# Altium schematic sheet sche_sim7600.SchDoc
size C
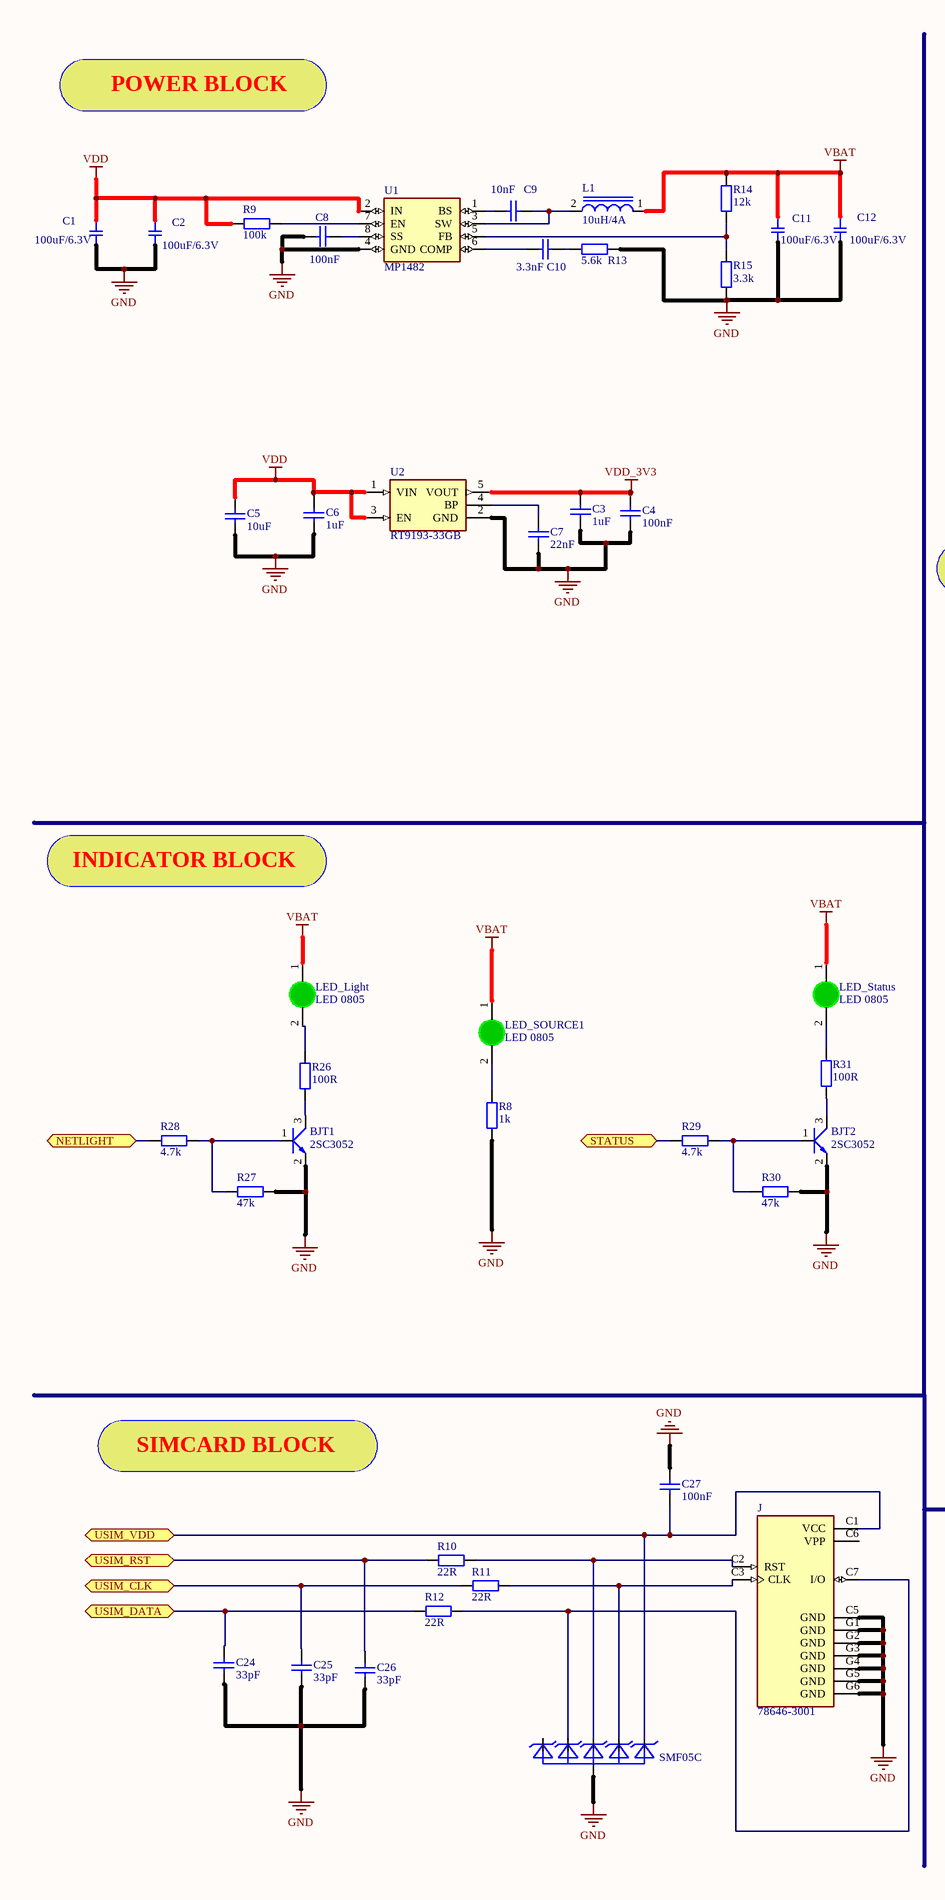
[diagram p0: sche_sim7600.SchDoc, left]
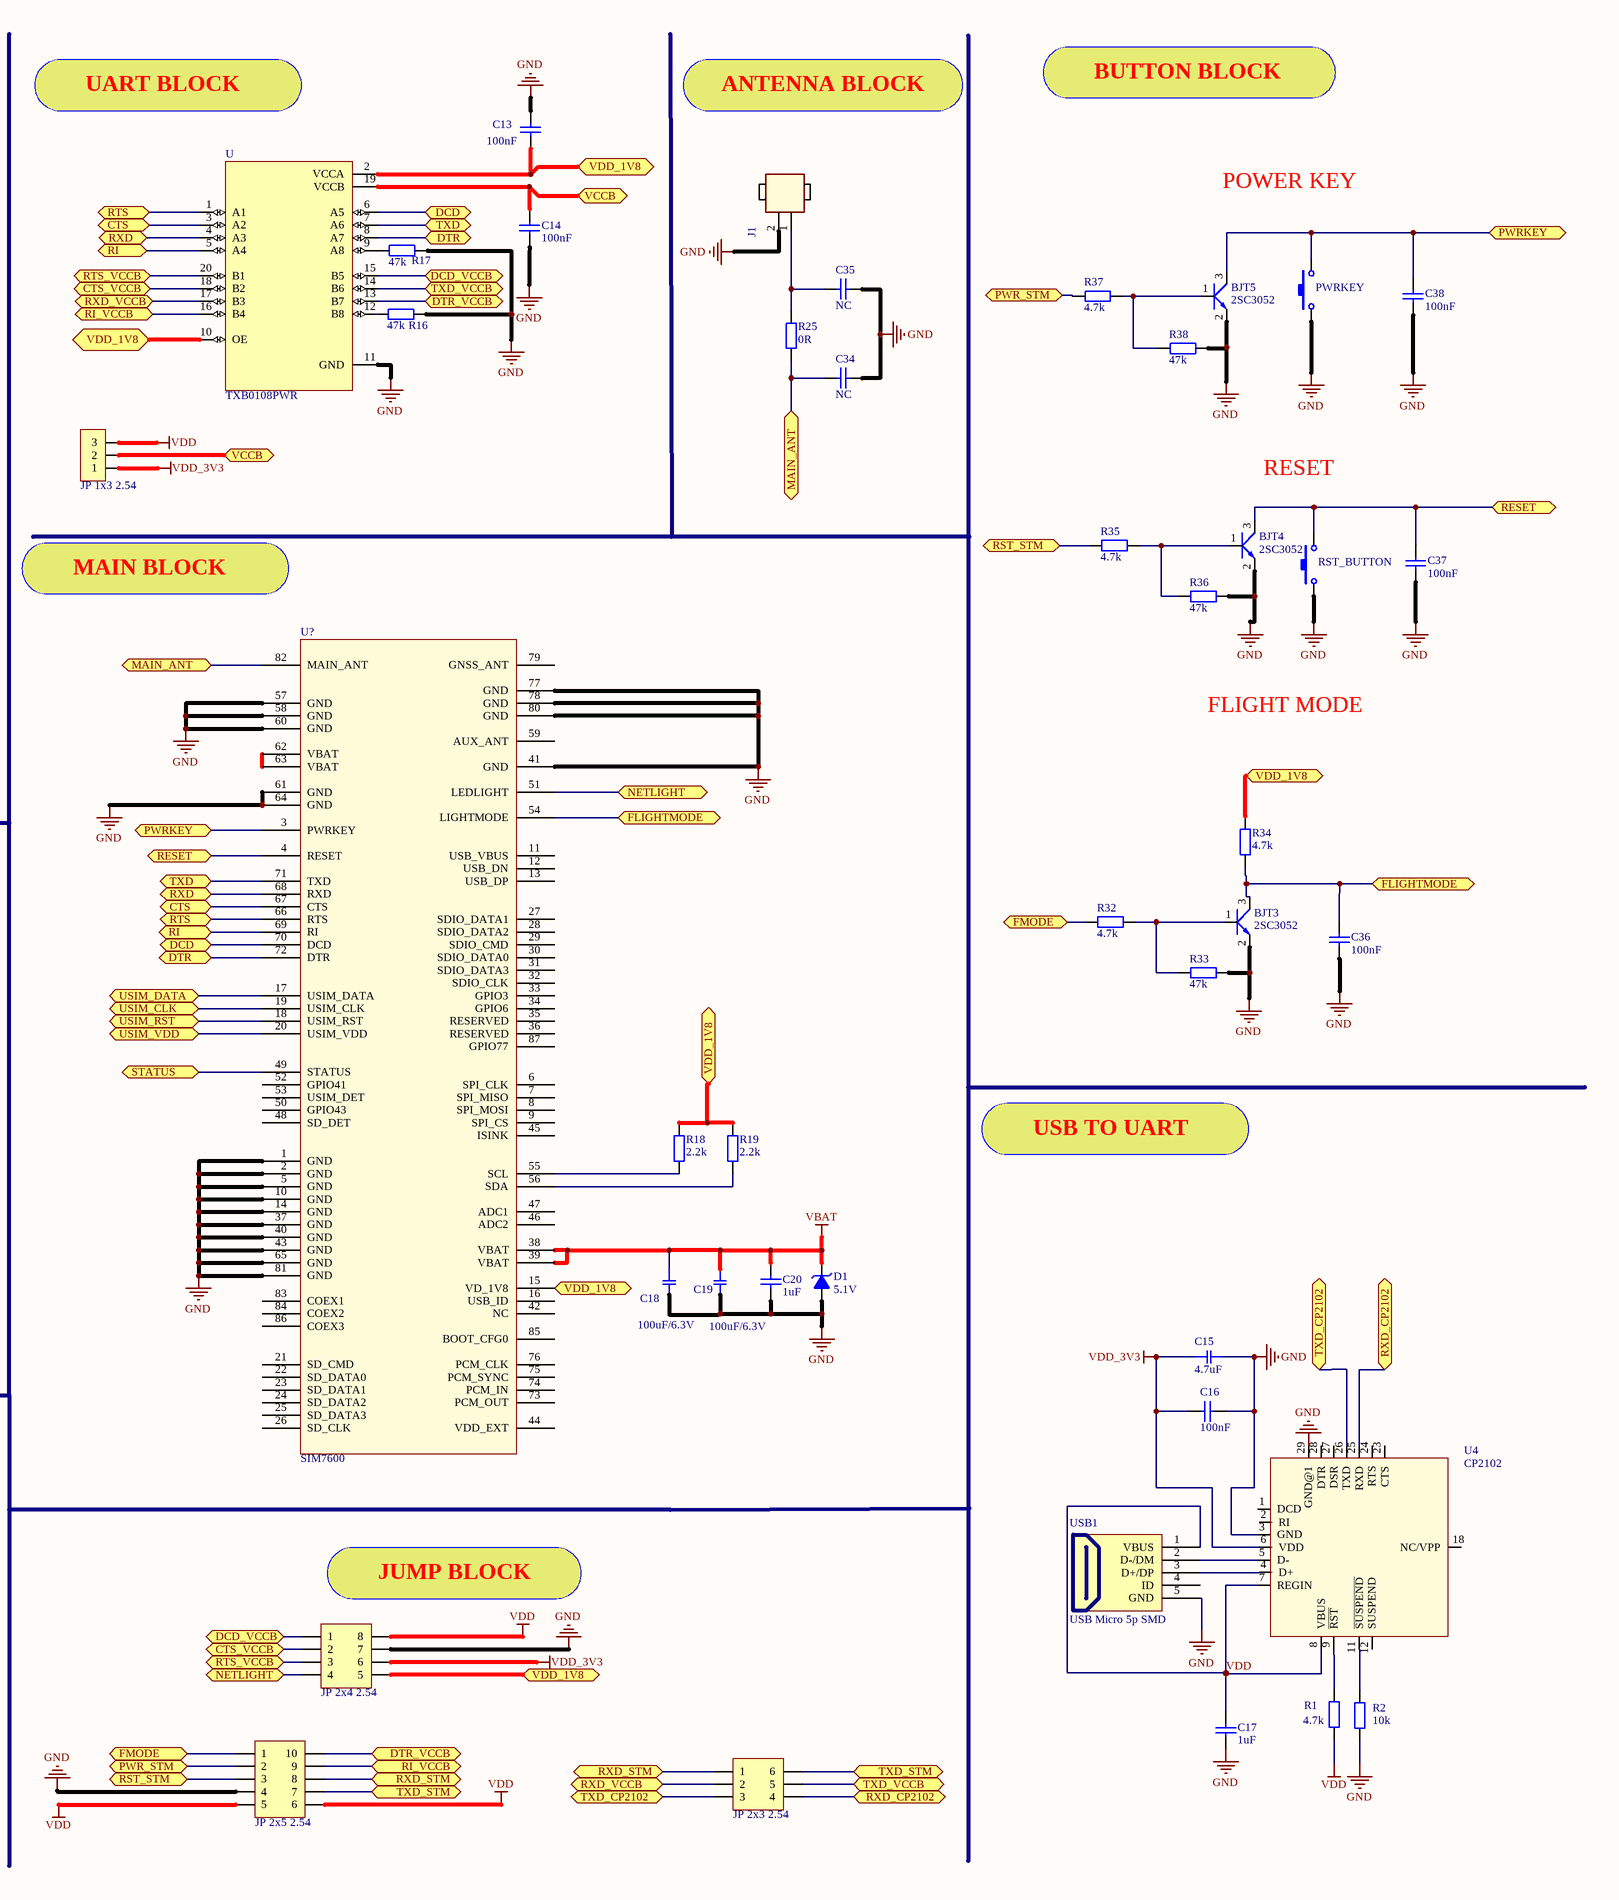
[diagram p1: sche_sim7600.SchDoc, right]

## Parts
BJT1  2SC3052  [SOT23-3]
BJT2  2SC3052  [SOT23-3]
BJT3  2SC3052  [SOT23-3]
BJT4  2SC3052  [SOT23-3]
BJT5  2SC3052  [SOT23-3]
C1  100uF/6.3V  [SMD-1210C]
C2  100uF/6.3V  [SMD-1210C]
C3  1uF  [tu 0805]
C4  100nF  [tu 0805]
C5  10uF  [tu 1206]
C6  1uF  [tu 0805]
C7  22nF  [tu 0805]
C8  100nF  [tu 0805]
C9  10nF  [tu 0805]
C10  3.3nF  [tu 0805]
C11  100uF/6.3V  [SMD-1210C]
C12  100uF/6.3V  [SMD-1210C]
C13  100nF  [tu 0805]
C14  100nF  [tu 0805]
C15  4.7uF  [SMD-1210C]
C16  100nF  [tu 0805]
C17  1uF  [tu 0805]
C18  100uF/6.3V  [SMD-1210C]
C19  100uF/6.3V  [SMD-1210C]
C20  1uF  [tu 0805]
C24  33pF  [tu 0805]
C25  33pF  [tu 0805]
C26  33pF  [tu 0805]
C27  100nF  [tu 0805]
C34  NC  [tu 0603]
C35  NC  [tu 0603]
C36  100nF  [tu 0805]
C37  100nF  [tu 0805]
C38  100nF  [tu 0805]
D  SMF05C  [SC70-6]
D1  5.1V  [DIODE ZENNER SMD SOD80]
J  78646-3001  [MOLEX_78646-3001]
J1  SMA  [*SAMTEC_SMA-J-P-H-RA-TH1]  (value not drawn)
JP1  JP 1x3 2.54  [JP 1x3 DT]
JP3  JP 2x5 2.54  [JP 2x5 DT]
JP4  JP 2x3 2.54  [JP 2x3 DT]
JP?  JP 2x4 2.54  [JP 2x4 DT]
L1  10uH/4A  [INDP125125X600N]
LED_Light  LED 0805  [LED-0805-Green]
LED_SOURCE1  LED 0805  [LED-0805-Green]
LED_Status  LED 0805  [LED-0805-Green]
PWRKEY  Nut Nhan 2 Chan SMD 3x6x2.5  [Nut Nhan 2 Chan SMD 3x6x2.5]  (value not drawn)
R1  4.7k  [tro smd 0805]
R2  10k  [tro smd 0805]
R8  1k  [tro smd 0805]
R9  100k  [tro smd 0805]
R10  22R  [tro smd 0805]
R11  22R  [tro smd 0805]
R12  22R  [tro smd 0805]
R13  5.6k  [tro smd 0805]
R14  12k  [tro smd 0805]
R15  3.3k  [tro smd 0805]
R16  47k  [tro smd 0805]
R17  47k  [tro smd 0805]
R18  2.2k  [tro smd 0805]
R19  2.2k  [tro smd 0805]
R25  0R  [tro smd 0805]
R26  100R  [tro smd 0805]
R27  47k  [tro smd 0805]
R28  4.7k  [tro smd 0805]
R29  4.7k  [tro smd 0805]
R30  47k  [tro smd 0805]
R31  100R  [tro smd 0805]
R32  4.7k  [tro smd 0805]
R33  47k  [tro smd 0805]
R34  4.7k  [tro smd 0805]
R35  4.7k  [tro smd 0805]
R36  47k  [tro smd 0805]
R37  4.7k  [tro smd 0805]
R38  47k  [tro smd 0805]
RST_BUTTON  Nut Nhan 2 Chan SMD 3x6x2.5  [Nut Nhan 2 Chan SMD 3x6x2.5]  (value not drawn)
U  TXB0108PWR  [SOP65P640X120-20N]
U1  MP1482  [SOIC8]
U2  RT9193-33GB  [SOT94P279X129-5N]
U4  CP2102  [QFN28G_0.5-5X5MM]
U?  SIM7600  [IC_SIM7600E-H]
USB1  USB Micro 5p SMD  [USB Micro 5P SMD]

## Ports
CTS, CTS_VCCB, DCD, DCD_VCCB, DTR, DTR_VCCB, FLIGHTMODE, FMODE, MAIN_ANT, NETLIGHT, PWR_STM, PWRKEY, RESET, RI, RI_VCCB, RST_STM, RTS, RTS_VCCB, RXD, RXD_CP2102, RXD_STM, RXD_VCCB, STATUS, TXD, TXD_CP2102, TXD_STM, TXD_VCCB, USIM_CLK, USIM_DATA, USIM_RST, USIM_VDD, VCCB, VDD_1V8

## Nets
GND: BJT1.2(E) BJT2.2(E) BJT3.2(E) BJT4.2(E) BJT5.2(E) C1.2 C2.2 C3.2 C4.2 C5.2 C6.2 C7.2 C8.2 C11.2 C12.2 C13.1 C14.2 C15.2 C16.2 C17.2 C18.2 C19.2 C20.2 C24.2 C25.2 C26.2 C27.1 C34.2 C35.2 C36.2 C37.2 C38.2 D.2(A) D1.1(A) J.C5(GND) J.G1(GND) J.G2(GND) J.G3(GND) J.G4(GND) J.G5(GND) J.G6(GND) J1.2 JP3.4 JP?.7 PWRKEY.1 R2.2 R8.2 R13.2 R15.1 R16.2 R17.2 R27.1 R30.1 R33.1 R36.1 R38.1 RST_BUTTON.1 U.11(GND) U1.4(GND) U2.2(GND) U4.3(GND) U4.29(GND@1) U?.1(GND) U?.2(GND) U?.5(GND) U?.10(GND) U?.14(GND) U?.37(GND) U?.40(GND) U?.41(GND) U?.43(GND) U?.57(GND) U?.58(GND) U?.60(GND) U?.61(GND) U?.64(GND) U?.65(GND) U?.77(GND) U?.78(GND) U?.80(GND) U?.81(GND) USB1.5(GND)
VBAT: C11.1 C12.1 C18.1 C19.1 C20.1 D1.2(K) L1.1 LED_Light.1(A) LED_SOURCE1.1(A) LED_Status.1(A) R14.2 U?.38(VBAT) U?.39(VBAT)
VDD: C1.1 C2.1 C5.1 C6.1 C17.1 JP1.3 JP3.5 JP3.6 JP?.8 R1.2 R9.1 U1.2(IN) U2.1(VIN) U2.3(EN) U4.7(REGIN) U4.8(VBUS) USB1.1(VBUS)
VDD_3V3: C3.1 C4.1 C15.1 C16.1 JP1.1 JP?.6 U2.5(VOUT) U4.6(VDD)
CTS: U.3(A2) U?.67(CTS) ; port CTS
CTS_VCCB: JP?.2 U.18(B2) ; port CTS_VCCB
DCD: U.6(A5) U?.70(DCD) ; port DCD
DCD_VCCB: JP?.1 U.15(B5) ; port DCD_VCCB
DTR: U.8(A7) U?.72(DTR) ; port DTR
DTR_VCCB: JP3.10 U.13(B7) ; port DTR_VCCB
FLIGHTMODE: BJT3.3(C) C36.1 R34.2 U?.54(LIGHTMODE) ; port FLIGHTMODE
FMODE: JP3.1 R32.2 ; port FMODE
MAIN_ANT: C34.1 R25.2 U?.82(MAIN_ANT) ; port MAIN_ANT
NETLIGHT: JP?.4 R28.2 U?.51(LEDLIGHT) ; port NETLIGHT
PWR_STM: JP3.2 R37.2 ; port PWR_STM
PWRKEY: BJT5.3(C) C38.1 PWRKEY.2 U?.3(PWRKEY) ; port PWRKEY
RESET: BJT4.3(C) C37.1 RST_BUTTON.2 U?.4(RESET) ; port RESET
RI: U.5(A4) U?.69(RI) ; port RI
RI_VCCB: JP3.9 U.16(B4) ; port RI_VCCB
RST_STM: JP3.3 R35.2 ; port RST_STM
RTS: U.1(A1) U?.66(RTS) ; port RTS
RTS_VCCB: JP?.3 U.20(B1) ; port RTS_VCCB
RXD: U.4(A3) U?.68(RXD) ; port RXD
RXD_CP2102: JP4.4 U4.25(RXD) ; port RXD_CP2102
RXD_STM: JP3.8 JP4.1 ; port RXD_STM
RXD_VCCB: JP4.2 U.17(B3) ; port RXD_VCCB
STATUS: R29.2 U?.49(STATUS) ; port STATUS
TXD: U.7(A6) U?.71(TXD) ; port TXD
TXD_CP2102: JP4.3 U4.26(TXD) ; port TXD_CP2102
TXD_STM: JP3.7 JP4.6 ; port TXD_STM
TXD_VCCB: JP4.5 U.14(B6) ; port TXD_VCCB
USIM_CLK: C25.1 R11.2 U?.19(USIM_CLK) ; port USIM_CLK
USIM_DATA: C24.1 R12.2 U?.17(USIM_DATA) ; port USIM_DATA
USIM_RST: C26.1 R10.2 U?.18(USIM_RST) ; port USIM_RST
USIM_VDD: C27.2 D.6(C5) J.C1(VCC) U?.20(USIM_VDD) ; port USIM_VDD
VCCB: C14.1 JP1.2 U.19(VCCB) ; port VCCB
VDD_1V8: C13.2 JP?.5 R18.2 R19.2 R34.1 U.2(VCCA) U.10(OE) U?.15(VD_1V8) ; port VDD_1V8
NetBJT1_1: BJT1.1(B) R27.2 R28.1
NetBJT1_3: BJT1.3(C) R26.2
NetBJT2_1: BJT2.1(B) R29.1 R30.2
NetBJT2_3: BJT2.3(C) R31.1
NetBJT3_1: BJT3.1(B) R32.1 R33.2
NetBJT4_1: BJT4.1(B) R35.1 R36.2
NetBJT5_1: BJT5.1(B) R37.1 R38.2
NetC7_1: C7.1 U2.4(BP)
NetC8_1: C8.1 U1.8(SS)
NetC9_1: C9.1 L1.2 U1.3(SW)
NetC9_2: C9.2 U1.1(BS)
NetC10_1: C10.1 R13.1
NetC10_2: C10.2 U1.6(COMP)
NetC35_1: C35.1 J1.1 R25.1
NetD_3: D.3(C2) J.C7(I/O) R12.1
NetD_4: D.4(C3) J.C2(RST) R10.1
NetD_5: D.5(C4) J.C3(CLK) R11.1
NetLED_Light_2: LED_Light.2(K) R26.1
NetLED_SOURCE1_2: LED_SOURCE1.2(K) R8.1
NetLED_Status_2: LED_Status.2(K) R31.2
NetR1_1: R1.1 U4.9(~{RST})
NetR2_1: R2.1 U4.11(~{SUSPEND})
NetR9_2: R9.2 U1.7(EN)
NetR14_1: R14.1 R15.2 U1.5(FB)
NetR16_1: R16.1 U.12(B8)
NetR17_1: R17.1 U.9(A8)
NetR18_1: R18.1 U?.55(SCL)
NetR19_1: R19.1 U?.56(SDA)
NetU4_4: U4.4(D+) USB1.3(D+/DP)
NetU4_5: U4.5(D-) USB1.2(D-/DM)
NetU?_62: U?.62(VBAT) U?.63(VBAT)

Not connected (* = marked no-connect by the designer): D 1(C1); J C6(VPP); U4 1(DCD) 2(RI) 12(SUSPEND) 18(NC/VPP) 23(CTS) 24(RTS) 27(DSR) 28(DTR); U? 6(SPI_CLK) 7(SPI_MISO) 8(SPI_MOSI) 9(SPI_CS) 11(USB_VBUS) 12(USB_DN) 13(USB_DP) 16(USB_ID) 21(SD_CMD) 22(SD_DATA0) 23(SD_DATA1) 24(SD_DATA2) 25(SD_DATA3) 26(SD_CLK) 27(SDIO_DATA1) 28(SDIO_DATA2) 29(SDIO_CMD) 30(SDIO_DATA0) 31(SDIO_DATA3) 32(SDIO_CLK) 33(GPIO3) 34(GPIO6) 35(RESERVED) 36(RESERVED) 42(NC) 44(VDD_EXT) 45(ISINK) 46(ADC2) 47(ADC1) 48(SD_DET) 50(GPIO43) 52(GPIO41) 53(USIM_DET) 59(AUX_ANT) 73(PCM_OUT) 74(PCM_IN) 75(PCM_SYNC) 76(PCM_CLK) 79(GNSS_ANT) 83(COEX1) 84(COEX2) 85(BOOT_CFG0) 86(COEX3) 87(GPIO77); USB1 4(ID)

## Notes on the sheet
- BUTTON BLOCK
- POWER BLOCK
- UART BLOCK
- ANTENNA BLOCK
- POWER KEY
- RESET
- MAIN BLOCK
- FLIGHT MODE
- INDICATOR BLOCK
- USB TO UART
- SIMCARD BLOCK
- JUMP BLOCK

## Library data of the parts
C1 C2 C11 C12 C15 C18 C19 = GRT32ER61H475ME01L: CAP CER 4.7UF 50V X5R 1210; Manufacturer: Murata Electronics North America; Factory Stock: 0; Unit Price (USD): 1.25; Minimum Quantity: 1; Value: 4.7µF; Tolerance: ±20%; Datasheets: http://search.murata.co.jp/Ceramy/image/img/A01X/G101/ENG/GRT32ER61H475ME01-01.pdf; Image: //media.digikey.com/Renders/Murata%20Renders/GRT%20Series%201210(3225%20Metric).jpg; Digi-Key Part Number: 490-12508-1-ND; Part Number: GRT32ER61H475ME01L; Quantity Available: 1000; @ qty: 0; Packaging: Cut Tape (CT); Series: GRT; Part Status: Active; Voltage: 50V; Temperature Coefficient: X5R; Operating Temperature: -55°C ~ 85°C; Features: -; Ratings: AEC-Q200; Applications: Automotive; Failure Rate: Surface Mount, MLCC; Mounting Type: 1210 (3225 Metric); Package / Case: 0.126" L x 0.098" W (3.20mm x 2.50mm); Size / Dimension: -; Height - Seated (Max): 0.106" (2.70mm); Thickness (Max): -; Lead Spacing: -
C3 C6 C7 C17 C20 = Tu 0805 10pF 50V 10%: Dán; Don_Vi: Con; So_Chan: 2; Ten_Linh_Kien: Tụ 0805 10P 10% 50V; Ma_Hang: MH004554; Chung_Loai: Dán; Kieu_Chan: *
C4 C8-C10 C13 C14 C16 C24-C27 C36-C38 = Tu 0805 105 50V 10%: Dán; Don_Vi: Con; So_Chan: 2; Ten_Linh_Kien: Tụ 0805 105-1uF 10% 50V; Ma_Hang: MH004552; Chung_Loai: Dán; Kieu_Chan: *
C5 = Tu 1206 4.7nF 50V: Dán; Don_Vi: Con; So_Chan: 2; Ten_Linh_Kien: Tụ 1206 4.7nF 50V NPO; Ma_Hang: MH007538; Chung_Loai: Dán; Kieu_Chan: *
C34 C35 = Tu 0603 22pF 50V 10%: Dán; Don_Vi: Con; So_Chan: 2; Ten_Linh_Kien: Tụ 0603 22pF 50V 10%; Ma_Hang: MH004570; Chung_Loai: Dán; Kieu_Chan: *
D = SMF05C: 12.5V Clamp 8A _8/20Âµs_ Ipp Tvs Diode Surface Mount SC-88/SC70-6/SOT-363; MF: ON Semiconductor; Availability: Unavailable; Price: None; Package: SOT-363 ON Semiconductor; Value: *; SnapEDA_Link: https://www.snapeda.com/parts/SMF05C/ON%20Semiconductor/view-part/2782704/?ref=snap; MP: SMF05C
D1 = Diode Zener 5.1V: Dán; Ma_Hang: MH002881; Ten_Linh_Kien: Diode Zener 1/2W 5.1V SMD1206 ZMM5.1; Don_Vi: Con; Kieu_Chan: *; Ghi_Chu: *; Chung_Loai: Dán
J = 78646-3001: 6 Position Card Connector Micro SIM Surface Mount, Right Angle Gold; MF: Molex; Price: None; Availability: Unavailable; Package: None; MP: 78646-3001; Value: *; SnapEDA_Link: https://www.snapeda.com/parts/78646-3001/Molex/view-part/75189/?ref=snap
J1 = SMAconnector: SMA antenna connector; Local Part Number: SMA-RAM-15; Local link: http://www.tme.vn/Product.aspx?id=1087#page=pro_info
JP1 = JP 1x3 2.54 Duc Thang: Cắm; Ten_Linh_Kien: Jump Đơn Đực 2.54MM 1x40P Thẳng 11MM; Don_Vi: Con; Ma_Hang: MH000903; Ghi_Chu: *; Kieu_Chan: *; Chung_Loai: Cắm
JP3 = JP 2x5 2.54 Duc Thang: Cắm; Ten_Linh_Kien: Jump Đôi Đực 2.54MM 2x40P Thẳng 11MM; Don_Vi: Con; Ma_Hang: MH002686; Ghi_Chu: *; Kieu_Chan: *; Chung_Loai: Cắm
JP4 = JP 2x3 2.54 Duc Thang: Cắm; Ten_Linh_Kien: Jump Đôi Đực 2.54MM 2x40P Thẳng 11MM; Don_Vi: Con; Ma_Hang: MH002686; Ghi_Chu: *; Kieu_Chan: *; Chung_Loai: Cắm
JP? = JP 2x4 2.54 Duc Thang: Cắm; Ten_Linh_Kien: Jump Đôi Đực 2.54MM 2x40P Thẳng 11MM; Don_Vi: Con; Ma_Hang: MH002686; Ghi_Chu: *; Kieu_Chan: *; Chung_Loai: Cắm
L1 = SRR1260-330M: 33ÂµH Shielded Wirewound Inductor 3A 60mOhm Max Nonstandard; MF: Bourns; Price: None; Package: Nonstandard Bourns; MP: SRR1260-330M; Value: *; SnapEDA_Link: https://www.snapeda.com/parts/SRR1260-330M/Bourns/view-part/378985/?ref=snap; Availability: Unavailable
LED_Light LED_SOURCE1 LED_Status = LED 0805 Xanh La: Dán; Don_Vi: Con; Ma_Hang: MH002326; Ten_Linh_Kien: LED 0805 Màu Xanh Lá (Green); Ghi_Chu: *; Kieu_Chan: *; Chung_Loai: Dán
PWRKEY RST_BUTTON = Nut Nhan 2 Chan SMD 3x6x2.5: Ma_Hang: MH001036; Ten: Nút Nhấn 2 Chân 3x6x2.5MM SMD
R1 R2 R8-R19 R25-R38 = Tro 0805 1% 1k: Dán; Don_Vi: Con; So_Chan: 2; Ten_Linh_Kien: Trở 0805 1% 1k; Ma_Hang: MH005468; Chung_Loai: Dán; Kieu_Chan: *
U = TXB0108PWR: 8-Bit Bidirectional Voltage-Level Shifter with Auto Direction Sensing and +/-15-kV ESD Protect 20-TSSOP -40 to 85; MF: Texas Instruments; SnapEDA_Link: https://www.snapeda.com/parts/TXB0108PWR/Texas%20Instruments/view-part/45111/?ref=snap; Digi-Key_Part_Number: 296-21527-1-ND; Texas_Instruments-Purchase-URL: https://snapeda.com/shop?store=Texas+Instruments&id=45111; Package: TSSOP-20 Texas Instruments; Value: *; MP: TXB0108PWR
U1 = MP1482: Buck Switching Regulator IC Positive Adjustable 0.923V 1 Output 2A 8-SOIC _0.154, 3.90mm Width_; MF: Monolithic Power; Price: None; SnapEDA_Link: https://www.snapeda.com/parts/MP1482/Monolithic%20Power%20Systems%20Inc./view-part/2781922/?ref=snap; Availability: Unavailable; Value: *; MP: MP1482; Package: SOIC-8 Monolithic Power
U2 = RT9193-33GB: Linear Voltage Regulator IC 1 Output 300mA SOT-23-5; MF: Richtek USA; Availability: Unavailable; MP: RT9193-33GB; Package: SOT-23-5 Richtek; SnapEDA_Link: https://www.snapeda.com/parts/RT9193-33GB/Richtek%20USA%20Inc./view-part/55570/?ref=snap; Value: *; Price: None
U4 = INTERFACE-CP2102-GMR(QFN28): USB Bridge, USB to UART USB 2.0 UART Interface 28-QFN _5x5_; MF: Silicon; SnapEDA_Link: https://www.snapeda.com/parts/CP2102-GMR/Silicon%20Labs/view-part/570818/?ref=snap; MP: CP2102-GMR; Price: None; Availability: Unavailable; Value: *; Package: VFQFN-28 Vishay Siliconix
USB1 = USB Micro 5p SMD: USB Type B; Ten: MicroUSB MK5P SMD; Ma_Hang: MH001020